# EAGLE design rocket_pack-compact (EAGLE 6.3)
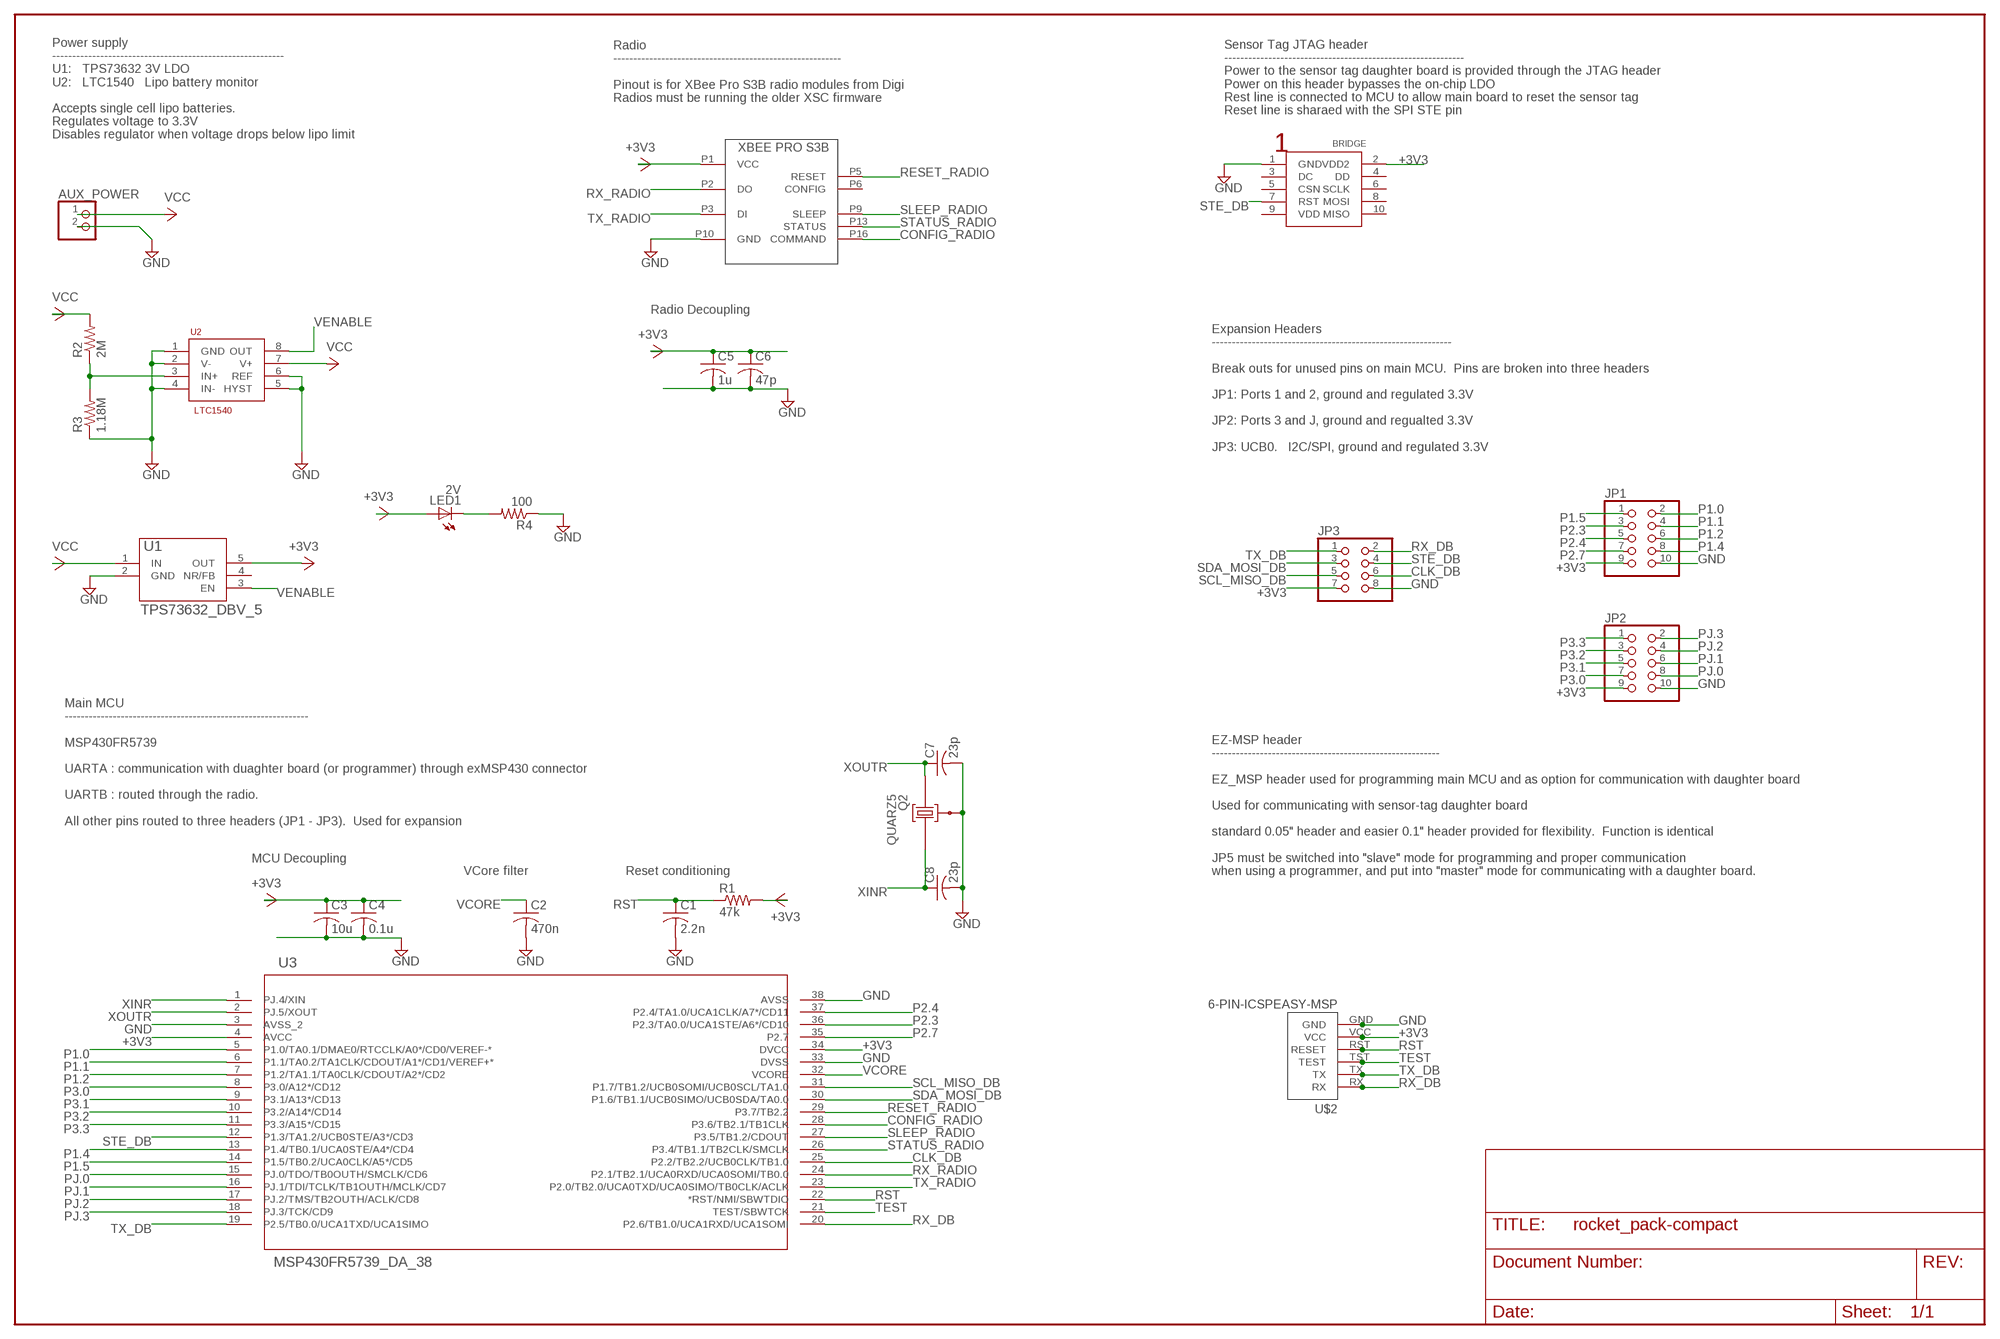
[diagram p0: schematic, sheet 1]

## Parts
AUX_POWER  PINHD-1X2  [1X02]
BRIDGE  CC-DEBUG  [2X5-1.27MM]
C1  2.2n  C-USC1206  [C1206]
C2  470n  C-USC1206  [C1206]
C3  10u  C-USC1206  [C1206]
C4  0.1u  C-USC1206  [C1206]
C5  1u  C-USC1206  [C1206]
C6  47p  C-USC1206  [C1206]
C7  23p  C-USC1206  [C1206]
C8  23p  C-USC1206  [C1206]
JP1  PINHD-2X5  [2X05]
JP2  PINHD-2X5  [2X05]
JP3  PINHD-2X4  [2X04]
LED1  2V  LEDSMT1206  [1206]
Q2  QUARZ5  [QUARZ5]
R1  47k  R-US_R1206  [R1206]
R2  2M  R-US_R1206  [R1206]
R3  1.18M  R-US_R1206  [R1206]
R4  100  R-US_R1206  [R1206]
U1  TPS73632_DBV_5  [DBV5]
U2  LTC1540  [S8]
U3  MSP430FR5739_DA_38  [DA38]
U$1  XBEE_PRO_S3B  [PRO_S3B]
U$2  6-PIN-ICSPEASY-MSP  [EASYMSP-6PIN]

## Nets
+3V3: BRIDGE.2(VDD2) C3.1 C4.1 C5.1 C6.1 JP1.9 JP2.9 JP3.7 LED1.A R1.2 U1.5(OUT) U3.4(AVCC) U3.34(DVCC) U$1.P1(VCC) U$2.VCC
CLK_DB: JP3.6 U3.25(P2.2/TB2.2/UCB0CLK/TB1.0)
CONFIG_RADIO: U3.28(P3.6/TB2.1/TB1CLK) U$1.P16(COMMAND)
GND: AUX_POWER.2 BRIDGE.1(GND) C1.2 C2.2 C3.2 C4.2 C5.2 C6.2 C7.2 C8.2 JP1.10 JP2.10 JP3.8 Q2.GND@0 R3.1 R4.1 U1.2(GND) U2.1(GND) U2.2(V-) U2.4(IN-) U2.5(HYST) U2.6(REF) U3.3(AVSS_2) U3.33(DVSS) U3.38(AVSS) U$1.P10(GND) U$2.GND
LED: LED1.C R4.2
N$1: R2.1 R3.2 U2.3(IN+)
P1.0: JP1.2 U3.5(P1.0/TA0.1/DMAE0/RTCCLK/A0*/CD0/VEREF-*)
P1.1: JP1.4 U3.6(P1.1/TA0.2/TA1CLK/CDOUT/A1*/CD1/VEREF+*)
P1.2: JP1.6 U3.7(P1.2/TA1.1/TA0CLK/CDOUT/A2*/CD2)
P1.4: JP1.8 U3.13(P1.4/TB0.1/UCA0STE/A4*/CD4)
P1.5: JP1.1 U3.14(P1.5/TB0.2/UCA0CLK/A5*/CD5)
P2.3: JP1.3 U3.36(P2.3/TA0.0/UCA1STE/A6*/CD10)
P2.4: JP1.5 U3.37(P2.4/TA1.0/UCA1CLK/A7*/CD11)
P2.7: JP1.7 U3.35(P2.7)
P3.0: JP2.7 U3.8(P3.0/A12*/CD12)
P3.1: JP2.5 U3.9(P3.1/A13*/CD13)
P3.2: JP2.3 U3.10(P3.2/A14*/CD14)
P3.3: JP2.1 U3.11(P3.3/A15*/CD15)
PJ.0: JP2.8 U3.15(PJ.0/TDO/TB0OUTH/SMCLK/CD6)
PJ.1: JP2.6 U3.16(PJ.1/TDI/TCLK/TB1OUTH/MCLK/CD7)
PJ.2: JP2.4 U3.17(PJ.2/TMS/TB2OUTH/ACLK/CD8)
PJ.3: JP2.2 U3.18(PJ.3/TCK/CD9)
RESET_RADIO: U3.29(P3.7/TB2.2) U$1.P5(RESET)
RST: C1.1 R1.1 U3.22(*RST/NMI/SBWTDIO) U$2.RST(RESET)
RX_DB: JP3.2 U3.20(P2.6/TB1.0/UCA1RXD/UCA1SOMI) U$2.RX
RX_RADIO: U3.24(P2.1/TB2.1/UCA0RXD/UCA0SOMI/TB0.0) U$1.P2(DO)
SCL_MISO_DB: JP3.5 U3.31(P1.7/TB1.2/UCB0SOMI/UCB0SCL/TA1.0)
SDA_MOSI_DB: JP3.3 U3.30(P1.6/TB1.1/UCB0SIMO/UCB0SDA/TA0.0)
SLEEP_RADIO: U3.27(P3.5/TB1.2/CDOUT) U$1.P9(SLEEP)
STATUS_RADIO: U3.26(P3.4/TB1.1/TB2CLK/SMCLK) U$1.P13(STATUS)
STE_DB: BRIDGE.7(RST) JP3.4 U3.12(P1.3/TA1.2/UCB0STE/A3*/CD3)
TEST: U3.21(TEST/SBWTCK) U$2.TST(TEST)
TX_DB: JP3.1 U3.19(P2.5/TB0.0/UCA1TXD/UCA1SIMO) U$2.TX
TX_RADIO: U3.23(P2.0/TB2.0/UCA0TXD/UCA0SIMO/TB0CLK/ACLK) U$1.P3(DI)
VCC: AUX_POWER.1 R2.2 U1.1(IN) U2.7(V+)
VCORE: C2.1 U3.32(VCORE)
VENABLE: U1.3(EN) U2.8(OUT)
XINR: C8.1 Q2.1 U3.1(PJ.4/XIN)
XOUTR: C7.1 Q2.2 U3.2(PJ.5/XOUT)
Unconnected: BRIDGE.3(DC) BRIDGE.4(DD) BRIDGE.5(CSN) BRIDGE.6(SCLK) BRIDGE.8(MOSI) BRIDGE.9(VDD) BRIDGE.10(MISO) U1.4(NR/FB) U$1.P6(CONFIG)

## Notes on the sheet
- Radio
  ---------------------------------------------------------
  
  Pinout is for XBee Pro S3B radio modules from Digi
  Radios must be running the older XSC firmware
- Sensor Tag JTAG header
  ------------------------------------------------------------
  Power to the sensor tag daughter board is provided through the JTAG header
  Power on this header bypasses the on-chip LDO
  Rest line is connected to MCU to allow main board to reset the sensor tag
  Reset line is sharaed with the SPI STE pin
- Power supply
  ----------------------------------------------------------
  U1:   TPS73632 3V LDO
  U2:   LTC1540   Lipo battery monitor
  
  Accepts single cell lipo batteries.  
  Regulates voltage to 3.3V
  Disables regulator when voltage drops below lipo limit
- Radio Decoupling
- Expansion Headers
  ------------------------------------------------------------
  
  Break outs for unused pins on main MCU.  Pins are broken into three headers
  
  JP1: Ports 1 and 2, ground and regulated 3.3V
  
  JP2: Ports 3 and J, ground and regualted 3.3V
  
  JP3: UCB0.   I2C/SPI, ground and regulated 3.3V
- Main MCU
  -------------------------------------------------------------
  
  MSP430FR5739
  
  UARTA : communication with duaghter board (or programmer) through exMSP430 connector
  
  UARTB : routed through the radio.  
  
  All other pins routed to three headers (JP1 - JP3).  Used for expansion
- MCU Decoupling
- VCore filter | Reset conditioning
- EZ-MSP header
  ---------------------------------------------------------
  
  EZ_MSP header used for programming main MCU and as option for communication with daughter board
  
  Used for communicating with sensor-tag daughter board
  
  standard 0.05" header and easier 0.1" header provided for flexibility.  Function is identical
  
  JP5 must be switched into "slave" mode for programming and proper communication
  when using a programmer, and put into "master" mode for communicating with a daughter board.

## Library data of the parts
AUX_POWER = pinhead:PINHD-1X2: PIN HEADER
BRIDGE = connectors:CC-DEBUG
C1-C8 = adafruit:C-US: CAPACITOR, American symbol
JP1 JP2 = pinhead:PINHD-2X5: PIN HEADER
JP3 = adafruit:PINHD-2X4: PIN HEADER
LED1 = adafruit:LED: LED OSRAM: - CHIPLED LG R971, LG N971, LY N971, LG Q971, LY Q971, LO R971, LY R971 LH N974, LH R974 LS Q976, LO Q976, LY Q976 LO Q996 - Hyper CHIPLED LW Q18S LB Q993, LB Q99A, LB R99A - SideLED LS A670, LO A670, LY A670, LG A670, LP A670 LB A673, LV A673, LT A673, LW A673 LH A674 LY A675 LS A676, LA A676, LO A676, LY A676, LW A676 LS A679, LY A679, LG A679 - Hyper Micro SIDELED® LS Y876, LA Y876, LO Y876, LY Y876 LT Y87S - SmartLED LW L88C, LW L88S LB L89C, LB L89S, LG L890 LS L89K, LO L89K, LY L89K LS L896, LA L896, LO L896, LY L896 - TOPLED LS T670, LO T670, LY T670, LG T670, LP T670 LSG T670, LSP T670, LSY T670, LOP T670, LYG T670 LG T671, LOG T671, LSG T671 LB T673, LV T673, LT T673, LW T673 LH T674 LS T676, LA T676, LO T676, LY T676, LB T676, LH T676, LSB T676, LW T676 LB T67C, LV T67C, LT T67C, LS T67K, LO T67K, LY T67K, LW E67C LS E67B, LA E67B, LO E67B, LY E67B, LB E67C, LV E67C, LT E67C LW T67C LS T679, LY T679, LG T679 LS T770, LO T770, LY T770, LG T770, LP T770 LB T773, LV T773, LT T773, LW T773 LH T774 LS E675, LA E675, LY E675, LS T675 LS T776, LA T776, LO T776, LY T776, LB T776 LHGB T686 LT T68C, LB T68C - Hyper Mini TOPLED® LB M676 - Mini TOPLED Santana® LG M470 LS M47K, LO M47K, LY M47K Source: http://www.osram.convergy.de/
Q2 = sMSP430:QUARZ5
R1-R4 = adafruit:R-US_: RESISTOR, American symbol
U1 = TexasInstruments:TPS73632_DBV_5; DATASHEETURL: http://www.ti.com/lit/gpn/TPS73632; DESCRIPTION: Single Output LDO, 400mA, Fixed(3.2V), Cap free, Low Noise, Reverse Current Protection; FAMILY_NAME: SINGLE CHANNEL LDO; GENERIC_PART_NUMBER: TPS73632; INDUSTRY_STD_PKG_TYPE: SOT-23; MANUFACTURER: Texas Instruments; MANUFACTURER_PART_NUMBER: tps73632_dbv_5; PACKAGE_DESIGNATOR: DBV; PIN_COUNT: 5; VENDOR: Texas Instruments
U2 = linear:LTC1540
U3 = TexasInstruments:MSP430FR5739_DA_38; DATASHEETURL: http://www.ti.com/lit/gpn/MSP430FR5739; DESCRIPTION: MSP430FR573x,MSP430FR572x Mixed Signal Microcontroller; FAMILY_NAME: FRAM Series; GENERIC_PART_NUMBER: MSP430FR5739; INDUSTRY_STD_PKG_TYPE: TSSOP; MANUFACTURER: Texas Instruments; MANUFACTURER_PART_NUMBER: msp430fr5739_da_38; PACKAGE_DESIGNATOR: DA; PIN_COUNT: 38; VENDOR: Texas Instruments
U$1 = xbee:XBEE_PRO_S3B
U$2 = LaunchFET:6-PIN-ICSP: 6 pin easy-msp formatted headers. Designed to make programming target boards with MSP430 Launchpad easier. EASYMSP: standard .05" pitch header to match launchpad SAFEMSP: .05" header with .025" offset Vcc to keep Geordi away

## Board
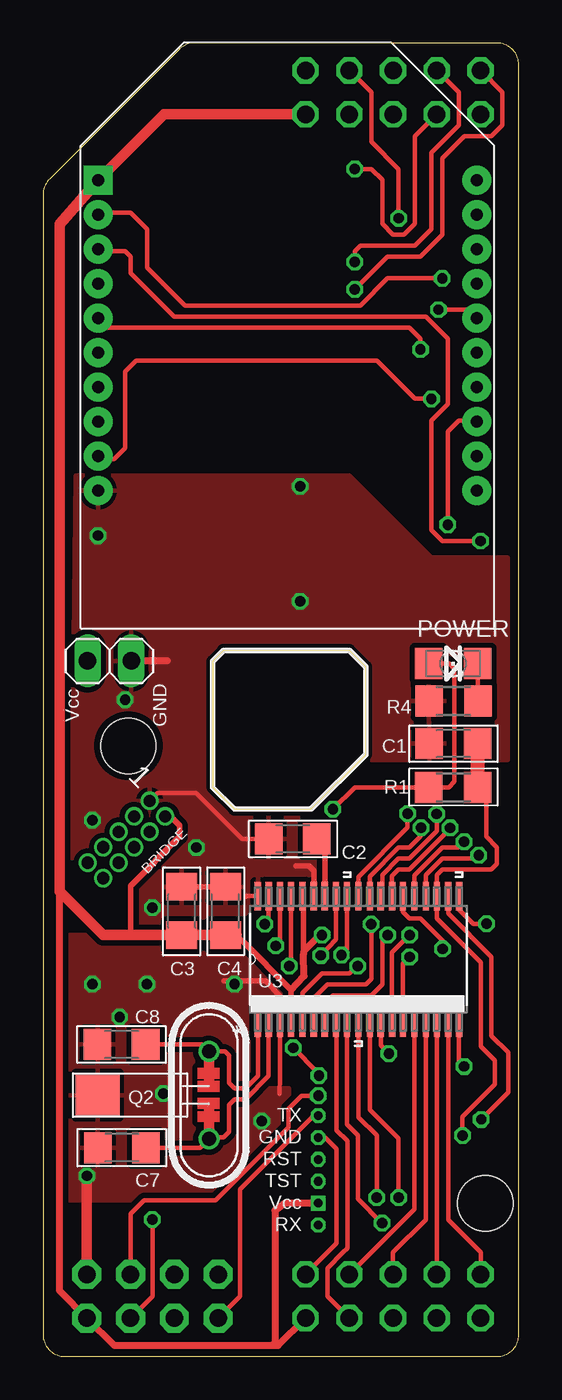
[diagram p1: board, top side]
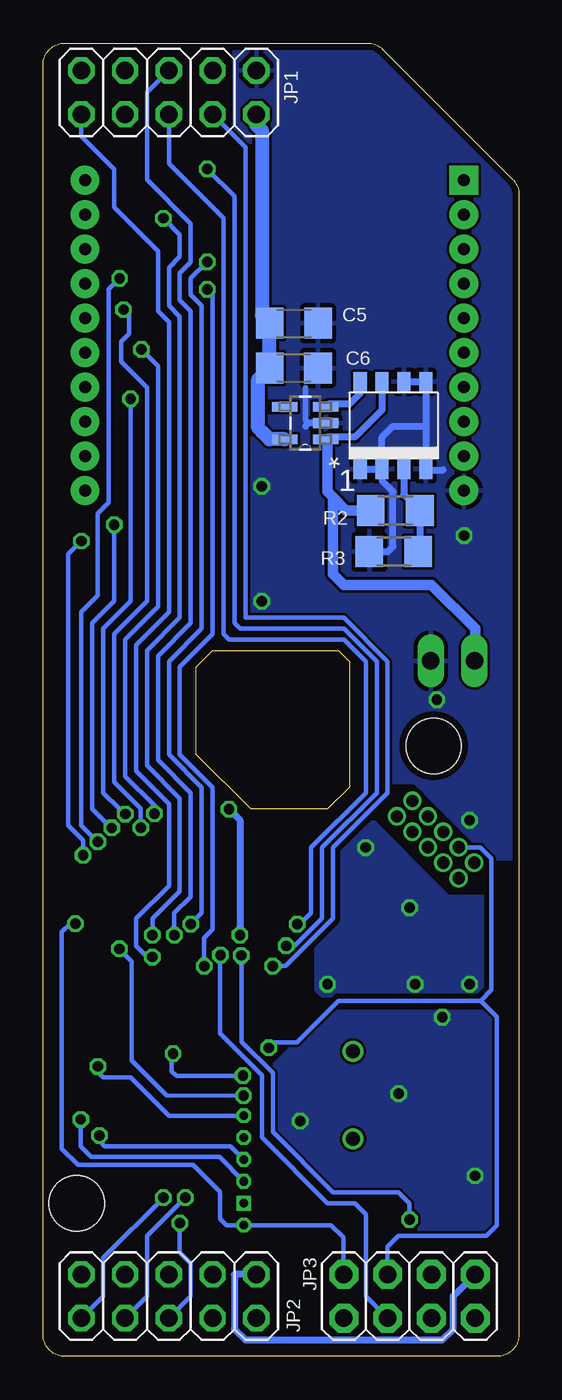
[diagram p2: board, bottom side, seen from below]

Size 27.62 x 76.2 mm. Coordinates in mm from the lower left corner, seen from the top.
Outline: 18.73,40 17.78,40.96 10.48,40.96 9.84,40.32 9.84,33.02 11.11,31.75 15.56,31.75 18.73,34.93 18.73,40
Outline: 0,67.42 0,1.27 arc90 1.27,0 26.35,0 arc90 27.62,1.27 27.62,74.93 arc90 26.35,76.2 8.78,76.2 arc45 7.88,75.83 0.37,68.32 arc45 0,67.42
Copper layers (1*16): Top 0.0356mm / dielectric 1.5011mm / Bottom 0.0356mm
Design rules "oshpark *": minimum track width 6mil, minimum drill 13mil, track to track 6mil, track to pad 6mil, pad to pad 6mil, via to via 6mil, smd to smd 6mil, copper to edge 15mil, drill to drill 6mil, minimum pad ring 7mil, minimum via ring 7mil, stop-mask expansion 4mil, vias tented up to drill 24mil, thermal gap 10mil
Holes 3.2 mm at 4.95,35.42 25.68,8.89

### Footprints (pad centres in the part's own frame; a part is rotated, then mirrored left to right if it is on the bottom)
1X02 = drill 1.016 long: 1 -1.27,0; 2 1.27,0
2X5-1.27MM = drill 0.7 pad 1.016: 1 0,0; 2 0,1.27; 3 1.27,0; 4 1.27,1.27; 5 2.54,0; 6 2.54,1.27; 7 3.81,0; 8 3.81,1.27; 9 5.08,0; 10 5.08,1.27
C1206 = smd 1.6 x 1.8: 1 -1.4,0; 2 1.4,0
2X05 = drill 1.016 octagon: 1 -5.08,-1.27; 2 -5.08,1.27; 3 -2.54,-1.27; 4 -2.54,1.27; 5 0,-1.27; 6 0,1.27; 7 2.54,-1.27; 8 2.54,1.27; 9 5.08,-1.27; 10 5.08,1.27
2X04 = drill 1.016 pad 1.676 octagon: 1 -3.81,-1.27; 2 -3.81,1.27; 3 -1.27,-1.27; 4 -1.27,1.27; 5 1.27,-1.27; 6 1.27,1.27; 7 3.81,-1.27; 8 3.81,1.27
1206 = smd 1.6 x 1.803: A -1.422,0; C 1.422,0
QUARZ5 = drill 0.813: 1 1.53,1.773; 2 1.52,-3.303 | smd 2.54 x 2.54: GND@0 -4.941,-0.762
R1206 = smd 1.6 x 1.803: 1 -1.422,0; 2 1.422,0
DBV5 = smd 1.473 x 0.559: 1 -1.194,0.94; 2 -1.194,0; 3 -1.194,-0.94; 4 1.194,-0.94; 5 1.194,0.94
S8 = smd 0.762 x 1.143: 1 -2.54,-2.54; 2 -1.27,-2.54; 3 0,-2.54; 4 1.27,-2.54; 5 1.27,2.54; 6 0,2.54; 7 -1.27,2.54; 8 -2.54,2.54
DA38 = smd 1.676 x 0.356: 1 -3.658,5.842; 2 -3.658,5.207; 3 -3.658,4.547; 4 -3.658,3.912; 5 -3.658,3.251; 6 -3.658,2.591; 7 -3.658,1.956; 8 -3.658,1.295; 9 -3.658,0.66; 10 -3.658,0; 11 -3.658,-0.66; 12 -3.658,-1.295; 13 -3.658,-1.956; 14 -3.658,-2.591; 15 -3.658,-3.251; 16 -3.658,-3.912; 17 -3.658,-4.547; 18 -3.658,-5.207; 19 -3.658,-5.842; 20 3.658,-5.842; 21 3.658,-5.207; 22 3.658,-4.547; 23 3.658,-3.912; 24 3.658,-3.251; 25 3.658,-2.591; 26 3.658,-1.956; 27 3.658,-1.295; 28 3.658,-0.66; 29 3.658,0; 30 3.658,0.66; 31 3.658,1.295; 32 3.658,1.956; 33 3.658,2.591; 34 3.658,3.251; 35 3.658,3.912; 36 3.658,4.547; 37 3.658,5.207; 38 3.658,5.842
PRO_S3B = drill 0.7 pad 1.676 square: P1 -11,0 | drill 0.7 pad 1.676: P2 -11,-2; P3 -11,-4; P4 -11,-6; P5 -11,-8; P6 -11,-10; P7 -11,-12; P8 -11,-14; P9 -11,-16; P10 -11,-18; P11 11,-18; P12 11,-16; P13 11,-14; P14 11,-12; P15 11,-10; P16 11,-8; P17 11,-6; P18 11,-4; P19 11,-2; P20 11,0
EASYMSP-6PIN = drill 0.5 octagon: GND 0,-1.27; RST 0,0; RX 0,3.81; TST 0,1.27; TX 0,-2.54 | drill 0.5 square: VCC 0,2.54

### Placement (x,y rotation side)
AUX_POWER  3.85,40.35 0 top
BRIDGE  6.19,32.24 225 top
C1  23.81,35.55 180 top
C2  14.5,30.03 180 top
C3  8.05,25.85 90 top
C4  10.59,25.85 90 top
C5  13.06,59.94 0 bottom
C6  13.06,57.35 0 bottom
C7  4.57,12.11 180 top
C8  4.56,18.1 180 top
JP1  20.32,73.34 0 bottom
JP2  20.32,3.49 0 bottom
JP3  6.35,3.49 0 bottom
LED1  23.8,40.2 0 top
Q2  8.1,15.92 0 top
R1  23.81,33.02 180 top
R2  7.17,49.08 180 bottom
R3  7.26,46.69 0 bottom
R4  23.83,38.02 0 top
U1  12.41,54.15 180 bottom
U2  6.68,54.01 0 bottom
U3  18.31,23.05 90 top
U$1  14.19,68.24 0 top
U$2  15.97,11.43 180 top

### Tracks (layer width: path | path; a pad name or v marks a point on that pad's centre or on a via)
+3V3  (via drill 0.6)
  Top 0.254: v16.83,31.75 18.1,33.02 R1.2 23.55,33.02 23.88,33.35 23.88,39.89 23.57,40.2 LED1.A | v16.19,24.45 16.08,24.45
  Top 0.305: U3.4 14.39,20.96 14.39,21.27 11.54,24.13 11.22,24.13 | 15.13,23.36 15.13,23.5 15.13,26.63 U3.34 | BRIDGE.2 7.4,31.34 7.94,30.8 7.94,30.16 5.08,27.31 5.08,24.45
  Top 0.406: 14.39,21.27 15.15,22.07 15.13,23.36 | 8.14,24.45 C3.1 | C4.1 11.22,24.45 | 16.08,24.45 15.13,23.5 | 0.95,26.99 0.95,3.81 JP3.7 4.13,0.63 13.3,0.63 | 13.3,0.63 13.65,0.63 JP2.9 | U$2.VCC 14.04,8.89 13.46,8.46 13.46,0.79 13.3,0.63
  Top 0.61: C4.1 C3.1 5.08,24.45 3.49,24.45 0.95,26.99 0.95,65.68 U$1.P1 7.03,72.07 JP1.9 | C4.1 | 11.22,24.45 11.22,24.13
  Bottom 0.406: v16.83,31.75 16.19,31.11 v16.19,24.45
  Bottom 0.61: 14.92,53.66 14.93,53.66 15.14,53.87
  Bottom 0.813: U1.5 14.48,53.21 14.92,53.66 | 15.14,53.87 15.14,56.68 C6.1 C5.1 14.92,60.41 14.92,71.12 15.24,71.44 JP1.9
CLK_DB  (via drill 0.6)
  Top 0.254: U3.25 20.9,25.78 21.27,25.4 21.91,25.4 23.2,24.11 v23.2,23.64 | JP3.6 5.08,8.28 5.87,9.07 10.02,9.07 14.24,13.28 14.24,14.37 14.99,15.12 v15.99,15.12
  Bottom 0.254: v15.99,15.12 20.46,15.15 22.48,17.17 22.48,22.93 v23.2,23.64
CONFIG_RADIO  (via drill 0.6)
  Top 0.254: U3.28 18.97,27.86 20.64,29.53 21.27,29.53 21.91,30.16 21.91,30.64 v21.95,30.67 | v22.95,60.73 24.66,60.73 24.97,60.46 U$1.P16
  Bottom 0.254: v21.95,30.67 21.95,31.79 23.5,33.34 23.5,41.91 21.59,43.82 21.59,56.2 23.1,57.71 23.1,58.87 22.64,59.33 22.64,60.42 v22.95,60.73
GND  (via drill 0.6)
  Top 0.254: C2.2 12.38,30.03 | 12.38,30.03 11.56,30.03 8.89,32.7 6.65,32.7 BRIDGE.1 | 12.46,29.95 12.38,30.03 | U3.38 11.78,26.7 11.75,26.67 | 13.76,18.84 13.76,16.22 13.73,15.23 | U$2.GND 16.38,12.7 17.04,12.04 17.04,6.56 JP2.10
  Top 0.305: C3.2 C4.2 | U3.3 13.76,20.93 12.91,21.78 10.5,21.78 | U3.33 15.71,28.18 15.45,28.44 14.68,28.44
  Top 0.406: 7.21,40.35 AUX_POWER.2
  Top 0.61: JP3.8 v2.54,10.48
  Bottom 0.305: 12.38,56.2 12.38,54.33 12.21,54.15
  Bottom 0.406: U2.6 U2.5 5.41,53.97 | 5.41,53.97 U2.4 5.37,51.43 4.39,51.43 | U2.1 U2.2 | U2.2 7.95,53.33 7.3,53.97 5.41,53.97 | R3.1 7.6,46.69 7.3,46.99 7.3,50.17 7.94,50.8 7.94,51.46 U2.2 | U1.2 12.21,54.15 12.38,53.97 | JP3.8 3.81,3.49 3.81,1.59 4.45,0.95 15.87,0.95 16.51,1.59 16.51,4.76 JP2.10
  other vias: 2.86,21.59 6.35,26.04 6.03,21.59 4.45,19.69 12.7,13.65 2.86,31.11 4.76,38.1 14.92,50.48 14.92,43.81 3.18,47.62 11.11,21.59 8.89,29.53 6.98,15.24
  pour Top (isolate 0.305): 11.43,24.45 1.27,24.45 1.27,9.07 10.66,9.07 14.29,12.7 14.29,15.56 12.38,15.56 12.38,20.32 13.97,20.32 13.97,21.27 12.7,22.54
  pour Top (isolate 0.305): 1.59,24.77 10.79,24.77 12.06,26.04 16.83,26.04 16.83,31.75 11.11,31.75 9.84,33.02 9.84,40.96 17.78,40.96 18.73,40 18.73,34.61 26.99,34.61 26.99,46.35 22.54,46.35 17.78,51.12 1.9,51.12
  pour Bottom (isolate 0.305): 1.59,26.67 4.13,26.67 8.89,31.43 11.75,31.43 11.75,21.27 11.43,20.96 1.59,20.96
  pour Bottom: 15.87,60.64 16.51,60.64 16.51,75.88 8.25,75.88 0,67.63 0,28.89 1.59,28.89 6.03,33.34 7.3,33.34 7.62,33.65 7.62,40.32 10.16,42.86 15.87,42.86
  pour Bottom: 1.27,20 1.27,6.99 8.25,6.99 14.29,13.02 14.29,16.83 11.11,20
LED
  Top 0.254: 24.66,38.02 R4.2 25.23,38.05 LED1.C
  Top 0.406: 25.3,38.08 R4.2
N$1
  Bottom 0.406: U2.3 6.68,50.01 R2.1 5.75,46.78 R3.2
P1.0  (via drill 0.6)
  Top 0.254: U3.5 15.05,21.09 16.19,22.23 17.78,22.23 v18.27,22.65 | v18.1,61.91 20,63.82 21.91,63.82 23.18,65.09 23.18,69.53 24.45,70.8 26.04,70.8 26.67,71.44 26.67,73.34 JP1.2
  Bottom 0.254: v18.1,61.91 17.78,61.6 17.78,41.91 19.69,40 19.69,34.93 17.78,33.02 17.78,24.76 18.27,24.28 v18.27,22.65
P1.1  (via drill 0.6)
  Top 0.254: U3.6 15.71,20.8 16.51,21.59 18.73,21.59 19.05,21.91 v19.05,25.08 | v18.1,63.5 18.1,64.13 18.42,64.45 21.59,64.45 22.54,65.41 22.54,69.85 24.13,71.44 24.13,73.34 JP1.4
  Bottom 0.254: v18.1,63.5 19.05,62.55 19.05,61.6 18.42,60.96 18.42,42.23 20.32,40.32 20.32,34.93 18.42,33.02 18.42,25.72 v19.05,25.08
P1.2  (via drill 0.6)
  Top 0.254: U3.7 16.35,20.48 16.83,20.96 19.05,20.96 19.69,21.59 19.69,24.13 v20,24.45
  Bottom 0.254: v20,24.45 20,25.72 19.05,26.67 19.05,32.7 20.96,34.61 20.96,40.64 19.05,42.54 19.05,60.64 19.69,61.28 19.69,62.86 19.05,63.5 19.05,65.72 21.59,68.26 21.59,73.34 JP1.6
P1.4  (via drill 0.6)
  Top 0.254: U3.13 20.26,23.44 v21.27,24.45 | v20.64,66.04 20.64,68.9 19.05,70.49 19.05,73.34 JP1.8
  Bottom 0.254: v20.64,66.04 19.69,65.09 19.69,63.82 20.32,63.18 20.32,60.96 19.69,60.33 19.69,42.86 21.59,40.96 21.59,34.29 19.69,32.39 19.69,26.99 21.27,25.4 v21.27,24.45
P1.5  (via drill 0.6)
  Top 0.254: U3.14 20.9,22.8 v21.27,23.18
  Bottom 0.254: v21.27,23.18 21.59,23.18 22.23,23.81 22.23,25.4 20.32,27.31 20.32,32.07 22.23,33.97 22.23,41.28 20.32,43.18 20.32,60.01 20.96,60.64 20.96,64.13 23.5,66.68 23.5,68.9 25.4,70.8 JP1.1
P2.3  (via drill 0.6)
  Top 0.254: U3.36 13.76,23.92 v13.51,23.82 | v18.1,68.9 19.05,68.9 19.69,68.26 19.69,65.72 20.32,65.09 20.96,65.09 21.59,65.72 21.59,70.8 JP1.3
  Bottom 0.254: v13.51,23.82 13.02,23.81 11.43,25.4 11.43,29.53 8.25,32.7 8.25,40.32 10.16,42.23 16.19,42.23 16.51,42.54 16.51,67.31 v18.1,68.9
P2.4  (via drill 0.6)
  Top 0.254: U3.37 13.1,25.16 v12.88,25.08
  Bottom 0.254: v12.88,25.08 12.7,25.08 12.06,25.72 12.06,29.53 8.89,32.7 8.89,40.32 10.16,41.59 16.83,41.59 17.14,41.91 17.14,66.04 20.32,69.22 JP1.5
P2.7  (via drill 0.6)
  Top 0.254: U3.35 14.39,22.75 v14.29,22.65
  Bottom 0.254: v14.29,22.65 13.54,22.65 10.79,25.4 10.79,29.53 7.62,32.7 7.62,40.32 10.16,42.86 15.87,42.86 15.87,70.17 JP1.7
P3.0
  Top 0.254: JP2.7 16.51,3.49 16.51,5.12 17.42,6.03 17.42,6.05 17.66,6.28 17.66,12.51 17.04,13.13 17.04,19.36 U3.8
P3.1  (via drill 0.6)
  Top 0.254: U3.9 17.65,13.45 18.28,12.82 18.28,9.14 v19.68,7.74
  Bottom 0.254: JP2.5 19.05,3.49 19.05,5.4 19.69,6.03 v19.69,7.73 v19.68,7.74
P3.2  (via drill 0.6)
  Top 0.254: U3.10 18.31,13.88 19.37,12.82 v19.37,9.21
  Bottom 0.254: v19.37,9.21 21.59,6.99 21.59,3.49 JP2.3
P3.3  (via drill 0.6)
  Top 0.254: U3.11 18.97,14.31 20.62,12.66 20.62,9.23 v20.64,9.21
  Bottom 0.254: v20.64,9.21 24.13,5.71 24.13,3.49 JP2.1
PJ.0
  Top 0.254: U3.15 21.56,8.54 JP2.8
PJ.1
  Top 0.254: U3.16 22.22,7.93 20.32,6.03 JP2.6
PJ.2
  Top 0.254: U3.17 JP2.4
PJ.3
  Top 0.254: U3.18 23.51,7.92 25.4,6.03 JP2.2
RESET_RADIO  (via drill 0.6)
  Top 0.254: U3.29 18.31,27.83 21.16,30.69 v21.16,31.5 | v21.91,58.42 21.91,59.06 21.27,59.69 3.74,59.69 U$1.P5
  Bottom 0.254: v21.16,31.5 21.16,31.96 22.86,33.65 22.86,41.59 20.96,43.5 20.96,57.47 v21.91,58.42
RST  (via drill 0.6)
  Top 0.254: 25.08,32.87 R1.1 | 25.21,33.04 R1.1 | R1.1 25.72,32.54 25.72,30.16 26.35,29.53 26.35,28.57 26.04,28.26 23.18,28.26 22.85,27.93 U3.22 22.85,25.41 25.4,22.86 25.4,17.99 26.22,17.17 26.22,15.77 24.35,13.91 v24.35,12.82
  Top 0.305: U3.22 22.84,26.72
  Top 0.813: C1.1 25.21,33.04
  Bottom 0.254: U$2.RST 16.74,12.2 24.04,12.2 24.35,12.51 v24.35,12.82
RX_DB  (via drill 0.6)
  Top 0.254: U3.20 24.15,25.93 24.97,25.11 v25.75,25.11
  Bottom 0.254: JP3.2 10.19,4.79 10.19,6.91 10.9,7.62 U$2.RX 16.97,7.62 17.35,7.99 17.35,9.55 18.9,11.11 25.59,11.11 26.53,12.04 26.53,24.64 26.06,25.11 v25.75,25.11
RX_RADIO  (via drill 0.6)
  Top 0.254: U3.24 21.56,27.91 23.18,29.53 24.12,29.53 v24.45,29.86 | v23.18,62.55 20,62.55 18.42,60.96 8.25,60.96 6.03,63.18 6.03,65.41 5.08,66.36 3.31,66.36 U$1.P2
  Bottom 0.254: v24.45,29.86 24.77,30.16 25.4,30.8 25.4,43.18 24.45,44.13 24.45,48.89 23.81,49.53 23.81,61.91 v23.18,62.55
SCL_MISO_DB  (via drill 0.6)
  Top 0.254: U3.31 17.02,24.19 v16.12,23.26 | v6.35,7.94 6.35,3.49 JP3.5
  Bottom 0.254: v6.35,7.94 6.35,8.89 6.98,9.52 10.79,9.52 14.29,13.02 14.29,16.45 16.1,18.26 16.1,22.73 16.12,22.75 v16.12,23.26
SDA_MOSI_DB  (via drill 0.6)
  Top 0.254: U3.30 17.65,23.61 v17.32,23.29
  Bottom 0.254: JP3.3 8.89,3.49 8.89,8.26 9.53,8.89 11.11,8.89 14.92,12.7 14.92,16.3 17.35,18.73 17.35,23.26 v17.32,23.29
SLEEP_RADIO  (via drill 0.6)
  Top 0.254: U3.27 19.69,26.79 19.69,27.94 20.64,28.89 21.27,28.89 22.86,30.48 22.86,31.34 v22.85,31.47 | v22.54,55.56 21.59,55.56 19.37,57.78 5.4,57.78 4.76,57.15 4.76,52.71 4.13,52.07 3.36,52.07 U$1.P9
  Bottom 0.254: v22.85,31.47 23.22,31.79 24.13,32.7 24.13,42.23 22.54,43.82 v22.54,55.56
STATUS_RADIO  (via drill 0.6)
  Top 0.254: U3.26 20.26,27.88 20.64,28.26 21.27,28.26 23.64,30.62 v23.64,30.66 | v23.5,48.26 23.5,53.66 24.13,54.29 25.14,54.29 U$1.P13
  Bottom 0.254: v23.64,30.66 23.68,30.66 24.77,31.75 24.77,42.54 23.5,43.82 v23.5,48.26
STE_DB  (via drill 0.6)
  Top 0.254: U3.12 19.6,18.04 v20.08,17.57 | v16.02,16.29 16.02,16.48 15.94,16.48 v14.52,17.9
  Bottom 0.254: BRIDGE.7 2.24,29.54 1.59,28.89 1.59,21.27 2.22,20.64 | 2.22,20.64 10.48,20.64 12.89,18.22 14.2,18.22 v14.52,17.9 | 2.22,20.64 1.27,19.69 1.27,7.62 1.9,6.99 6.98,6.99 7.62,6.35 JP3.4 | v16.02,16.29 19.89,16.29 20.15,16.55 20.15,17.49 v20.08,17.57
TEST  (via drill 0.6)
  Top 0.254: U3.21 23.51,25.7 26.04,23.18 26.04,18.6 26.99,17.64 26.99,15.31 v25.44,13.75
  Bottom 0.254: U$2.TST 17.39,11.57 24.82,11.57 25.44,12.2 v25.44,13.75
TX_DB  (via drill 0.6)
  Top 0.254: U3.19 24.15,17.13 v24.45,16.83 | JP3.1 11.44,3.5 11.44,9.71 15.7,13.97 U$2.TX
  Bottom 0.254: v24.45,16.83 24.45,16.51 24.13,16.19 22.54,16.19 20.32,13.97 16.59,13.97 U$2.TX
TX_RADIO  (via drill 0.6)
  Top 0.254: U3.23 22.22,27.93 23.18,28.89 25.11,28.89 v25.3,29.07 | v25.4,47.31 23.18,47.31 22.54,47.94 22.54,54.29 23.5,55.25 23.5,59.06 22.23,60.33 7.62,60.33 5.08,62.86 5.08,63.82 4.76,64.13 3.29,64.13 U$1.P3
  Bottom 0.254: v25.3,29.07 25.3,29.95 26.17,30.82 26.17,46.54 v25.4,47.31
VCC
  Bottom 0.406: U2.7 7.95,54.92 9.53,53.34 11.08,53.34 U1.1 11.11,53.11
  Bottom 0.61: R2.2 10.03,49.08 10.79,49.85 | 11.11,53.11 11.11,50.17 10.79,49.85 | 10.79,49.85 10.79,45.4 10.16,44.77 5.08,44.77 2.54,42.23 2.54,40.4 AUX_POWER.1
VCORE
  Top 0.305: U3.32 16.35,29.58 C2.1
VENABLE
  Bottom 0.406: U2.8 9.22,55.87 9.84,55.25 11.06,55.25 U1.3
XINR
  Top 0.254: 12.46,18.79 12.46,16.27 11.75,15.56 11.11,15.56 10.79,15.87 10.79,17.46 10.56,17.69 Q2.1 9.23,18.1 C8.1
  Top 0.305: 12.46,18.79 U3.1
XOUTR
  Top 0: 9.71,12.7 Q2.2
  Top 0.254: 9.71,12.7 10.48,12.7 10.79,13.02 10.79,14.6 11.11,14.92 11.75,14.92 13.1,16.27 U3.2 | C7.1 9.12,12.11 Q2.2

### Text on the board
tPlace: GND | Vcc
bStop: github.com/mjbeals/RocketPack
_tsilk: POWER
_bsilk: GND | P1.0 | P1.1 | P1.2 | P1.4 | +3.3V | P1.5 | P2.3 | P2.4 | P2.7 | GPIO 2 | GND | VCC | G / P / I / O / / 1 | Rocket Pack V0.2 | D / A / T / A | GND | PJ.0 | PJ.1 | PJ.2 | PJ.3 | GND | STE | CLK | RX | +3.3V | P3.0 | P3.1 | P3.2 | P3.3 | +3.3V | SCL, MISO | SDA, MOSI | TX